# Altium schematic sheet LEDs.SchDoc
size A3; SheetNumber: 3; SheetTotal: 4
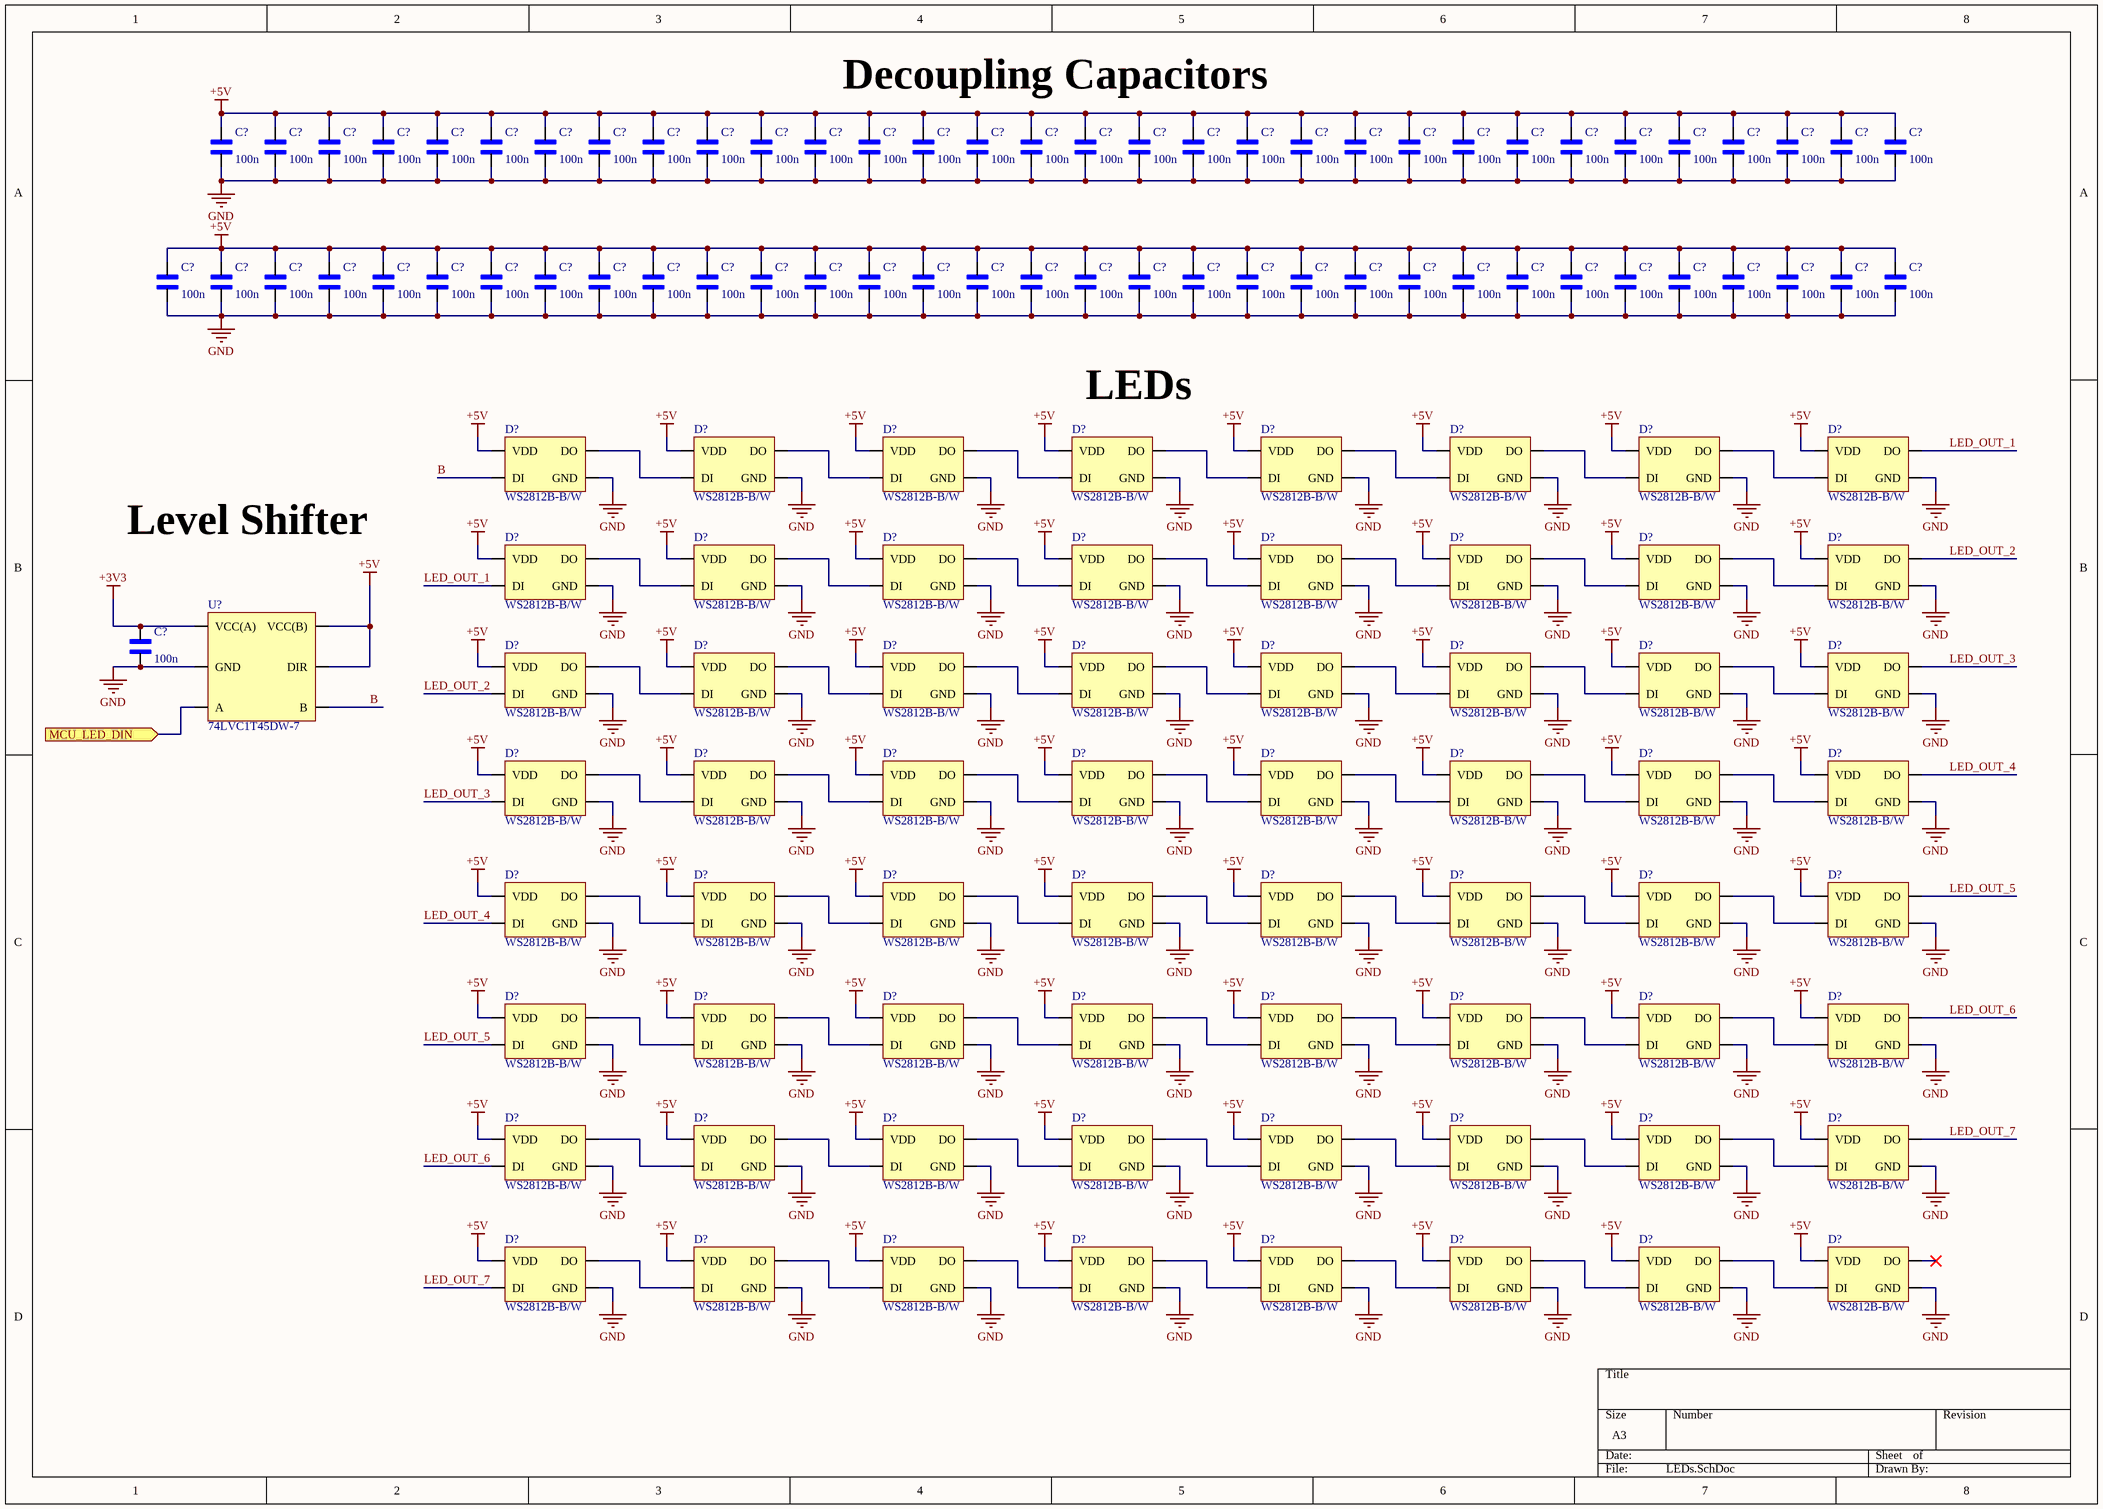
[diagram p0: LEDs.SchDoc]

## Parts
(Parts that share a designator on the sheet are numbered #1, #2 ... from top to bottom, then left to right.)
C?#1  100n  [CAP 0805]
C?#2  100n  [CAP 0805]
C?#3  100n  [CAP 0805]
C?#4  100n  [CAP 0805]
C?#5  100n  [CAP 0805]
C?#6  100n  [CAP 0805]
C?#7  100n  [CAP 0805]
C?#8  100n  [CAP 0805]
C?#9  100n  [CAP 0805]
C?#10  100n  [CAP 0805]
C?#11  100n  [CAP 0805]
C?#12  100n  [CAP 0805]
C?#13  100n  [CAP 0805]
C?#14  100n  [CAP 0805]
C?#15  100n  [CAP 0805]
C?#16  100n  [CAP 0805]
C?#17  100n  [CAP 0805]
C?#18  100n  [CAP 0805]
C?#19  100n  [CAP 0805]
C?#20  100n  [CAP 0805]
C?#21  100n  [CAP 0805]
C?#22  100n  [CAP 0805]
C?#23  100n  [CAP 0805]
C?#24  100n  [CAP 0805]
C?#25  100n  [CAP 0805]
C?#26  100n  [CAP 0805]
C?#27  100n  [CAP 0805]
C?#28  100n  [CAP 0805]
C?#29  100n  [CAP 0805]
C?#30  100n  [CAP 0805]
C?#31  100n  [CAP 0805]
C?#32  100n  [CAP 0805]
C?#33  100n  [CAP 0805]
C?#34  100n  [CAP 0805]
C?#35  100n  [CAP 0805]
C?#36  100n  [CAP 0805]
C?#37  100n  [CAP 0805]
C?#38  100n  [CAP 0805]
C?#39  100n  [CAP 0805]
C?#40  100n  [CAP 0805]
C?#41  100n  [CAP 0805]
C?#42  100n  [CAP 0805]
C?#43  100n  [CAP 0805]
C?#44  100n  [CAP 0805]
C?#45  100n  [CAP 0805]
C?#46  100n  [CAP 0805]
C?#47  100n  [CAP 0805]
C?#48  100n  [CAP 0805]
C?#49  100n  [CAP 0805]
C?#50  100n  [CAP 0805]
C?#51  100n  [CAP 0805]
C?#52  100n  [CAP 0805]
C?#53  100n  [CAP 0805]
C?#54  100n  [CAP 0805]
C?#55  100n  [CAP 0805]
C?#56  100n  [CAP 0805]
C?#57  100n  [CAP 0805]
C?#58  100n  [CAP 0805]
C?#59  100n  [CAP 0805]
C?#60  100n  [CAP 0805]
C?#61  100n  [CAP 0805]
C?#62  100n  [CAP 0805]
C?#63  100n  [CAP 0805]
C?#64  100n  [CAP 0805]
C?#65  100n  [CAP 0805]
C?#66  100n  [CAP 0805]
D?#1  WS2812B-B/W
D?#2  WS2812B-B/W
D?#3  WS2812B-B/W
D?#4  WS2812B-B/W
D?#5  WS2812B-B/W
D?#6  WS2812B-B/W
D?#7  WS2812B-B/W
D?#8  WS2812B-B/W
D?#9  WS2812B-B/W
D?#10  WS2812B-B/W
D?#11  WS2812B-B/W
D?#12  WS2812B-B/W
D?#13  WS2812B-B/W
D?#14  WS2812B-B/W
D?#15  WS2812B-B/W
D?#16  WS2812B-B/W
D?#17  WS2812B-B/W
D?#18  WS2812B-B/W
D?#19  WS2812B-B/W
D?#20  WS2812B-B/W
D?#21  WS2812B-B/W
D?#22  WS2812B-B/W
D?#23  WS2812B-B/W
D?#24  WS2812B-B/W
D?#25  WS2812B-B/W
D?#26  WS2812B-B/W
D?#27  WS2812B-B/W
D?#28  WS2812B-B/W
D?#29  WS2812B-B/W
D?#30  WS2812B-B/W
D?#31  WS2812B-B/W
D?#32  WS2812B-B/W
D?#33  WS2812B-B/W
D?#34  WS2812B-B/W
D?#35  WS2812B-B/W
D?#36  WS2812B-B/W
D?#37  WS2812B-B/W
D?#38  WS2812B-B/W
D?#39  WS2812B-B/W
D?#40  WS2812B-B/W
D?#41  WS2812B-B/W
D?#42  WS2812B-B/W
D?#43  WS2812B-B/W
D?#44  WS2812B-B/W
D?#45  WS2812B-B/W
D?#46  WS2812B-B/W
D?#47  WS2812B-B/W
D?#48  WS2812B-B/W
D?#49  WS2812B-B/W
D?#50  WS2812B-B/W
D?#51  WS2812B-B/W
D?#52  WS2812B-B/W
D?#53  WS2812B-B/W
D?#54  WS2812B-B/W
D?#55  WS2812B-B/W
D?#56  WS2812B-B/W
D?#57  WS2812B-B/W
D?#58  WS2812B-B/W
D?#59  WS2812B-B/W
D?#60  WS2812B-B/W
D?#61  WS2812B-B/W
D?#62  WS2812B-B/W
D?#63  WS2812B-B/W
D?#64  WS2812B-B/W
U?  74LVC1T45DW-7  [74LVC1T45DW-7]

## Ports
MCU_LED_DIN (in)

## Nets
+3V3: C?#66.2 U?.1(VCC(A))
+5V: C?#1.2 C?#2.2 C?#3.2 C?#4.2 C?#5.2 C?#6.2 C?#7.2 C?#8.2 C?#9.2 C?#10.2 C?#11.2 C?#12.2 C?#13.2 C?#14.2 C?#15.2 C?#16.2 C?#17.2 C?#18.2 C?#19.2 C?#20.2 C?#21.2 C?#22.2 C?#23.2 C?#24.2 C?#25.2 C?#26.2 C?#27.2 C?#28.2 C?#29.2 C?#30.2 C?#31.2 C?#32.2 C?#33.2 C?#34.2 C?#35.2 C?#36.2 C?#37.2 C?#38.2 C?#39.2 C?#40.2 C?#41.2 C?#42.2 C?#43.2 C?#44.2 C?#45.2 C?#46.2 C?#47.2 C?#48.2 C?#49.2 C?#50.2 C?#51.2 C?#52.2 C?#53.2 C?#54.2 C?#55.2 C?#56.2 C?#57.2 C?#58.2 C?#59.2 C?#60.2 C?#61.2 C?#62.2 C?#63.2 C?#64.2 C?#65.2 D?#1.1(VDD) D?#2.1(VDD) D?#3.1(VDD) D?#4.1(VDD) D?#5.1(VDD) D?#6.1(VDD) D?#7.1(VDD) D?#8.1(VDD) D?#9.1(VDD) D?#10.1(VDD) D?#11.1(VDD) D?#12.1(VDD) D?#13.1(VDD) D?#14.1(VDD) D?#15.1(VDD) D?#16.1(VDD) D?#17.1(VDD) D?#18.1(VDD) D?#19.1(VDD) D?#20.1(VDD) D?#21.1(VDD) D?#22.1(VDD) D?#23.1(VDD) D?#24.1(VDD) D?#25.1(VDD) D?#26.1(VDD) D?#27.1(VDD) D?#28.1(VDD) D?#29.1(VDD) D?#30.1(VDD) D?#31.1(VDD) D?#32.1(VDD) D?#33.1(VDD) D?#34.1(VDD) D?#35.1(VDD) D?#36.1(VDD) D?#37.1(VDD) D?#38.1(VDD) D?#39.1(VDD) D?#40.1(VDD) D?#41.1(VDD) D?#42.1(VDD) D?#43.1(VDD) D?#44.1(VDD) D?#45.1(VDD) D?#46.1(VDD) D?#47.1(VDD) D?#48.1(VDD) D?#49.1(VDD) D?#50.1(VDD) D?#51.1(VDD) D?#52.1(VDD) D?#53.1(VDD) D?#54.1(VDD) D?#55.1(VDD) D?#56.1(VDD) D?#57.1(VDD) D?#58.1(VDD) D?#59.1(VDD) D?#60.1(VDD) D?#61.1(VDD) D?#62.1(VDD) D?#63.1(VDD) D?#64.1(VDD) U?.5(DIR) U?.6(VCC(B))
GND: C?#1.1 C?#2.1 C?#3.1 C?#4.1 C?#5.1 C?#6.1 C?#7.1 C?#8.1 C?#9.1 C?#10.1 C?#11.1 C?#12.1 C?#13.1 C?#14.1 C?#15.1 C?#16.1 C?#17.1 C?#18.1 C?#19.1 C?#20.1 C?#21.1 C?#22.1 C?#23.1 C?#24.1 C?#25.1 C?#26.1 C?#27.1 C?#28.1 C?#29.1 C?#30.1 C?#31.1 C?#32.1 C?#33.1 C?#34.1 C?#35.1 C?#36.1 C?#37.1 C?#38.1 C?#39.1 C?#40.1 C?#41.1 C?#42.1 C?#43.1 C?#44.1 C?#45.1 C?#46.1 C?#47.1 C?#48.1 C?#49.1 C?#50.1 C?#51.1 C?#52.1 C?#53.1 C?#54.1 C?#55.1 C?#56.1 C?#57.1 C?#58.1 C?#59.1 C?#60.1 C?#61.1 C?#62.1 C?#63.1 C?#64.1 C?#65.1 C?#66.1 D?#1.4(GND) D?#2.4(GND) D?#3.4(GND) D?#4.4(GND) D?#5.4(GND) D?#6.4(GND) D?#7.4(GND) D?#8.4(GND) D?#9.4(GND) D?#10.4(GND) D?#11.4(GND) D?#12.4(GND) D?#13.4(GND) D?#14.4(GND) D?#15.4(GND) D?#16.4(GND) D?#17.4(GND) D?#18.4(GND) D?#19.4(GND) D?#20.4(GND) D?#21.4(GND) D?#22.4(GND) D?#23.4(GND) D?#24.4(GND) D?#25.4(GND) D?#26.4(GND) D?#27.4(GND) D?#28.4(GND) D?#29.4(GND) D?#30.4(GND) D?#31.4(GND) D?#32.4(GND) D?#33.4(GND) D?#34.4(GND) D?#35.4(GND) D?#36.4(GND) D?#37.4(GND) D?#38.4(GND) D?#39.4(GND) D?#40.4(GND) D?#41.4(GND) D?#42.4(GND) D?#43.4(GND) D?#44.4(GND) D?#45.4(GND) D?#46.4(GND) D?#47.4(GND) D?#48.4(GND) D?#49.4(GND) D?#50.4(GND) D?#51.4(GND) D?#52.4(GND) D?#53.4(GND) D?#54.4(GND) D?#55.4(GND) D?#56.4(GND) D?#57.4(GND) D?#58.4(GND) D?#59.4(GND) D?#60.4(GND) D?#61.4(GND) D?#62.4(GND) D?#63.4(GND) D?#64.4(GND) U?.2(GND)
B: D?#1.2(DI) U?.4(B)
LED_OUT_1: D?#8.3(DO) D?#9.2(DI)
LED_OUT_2: D?#16.3(DO) D?#17.2(DI)
LED_OUT_3: D?#24.3(DO) D?#25.2(DI)
LED_OUT_4: D?#32.3(DO) D?#33.2(DI)
LED_OUT_5: D?#40.3(DO) D?#41.2(DI)
LED_OUT_6: D?#48.3(DO) D?#49.2(DI)
LED_OUT_7: D?#56.3(DO) D?#57.2(DI)
MCU_LED_DIN: U?.3(A) ; port MCU_LED_DIN
NetD?#1_3: D?#1.3(DO) D?#2.2(DI)
NetD?#2_3: D?#2.3(DO) D?#3.2(DI)
NetD?#3_3: D?#3.3(DO) D?#4.2(DI)
NetD?#4_3: D?#4.3(DO) D?#5.2(DI)
NetD?#5_3: D?#5.3(DO) D?#6.2(DI)
NetD?#6_3: D?#6.3(DO) D?#7.2(DI)
NetD?#7_3: D?#7.3(DO) D?#8.2(DI)
NetD?#9_3: D?#9.3(DO) D?#10.2(DI)
NetD?#10_3: D?#10.3(DO) D?#11.2(DI)
NetD?#11_3: D?#11.3(DO) D?#12.2(DI)
NetD?#12_3: D?#12.3(DO) D?#13.2(DI)
NetD?#13_3: D?#13.3(DO) D?#14.2(DI)
NetD?#14_3: D?#14.3(DO) D?#15.2(DI)
NetD?#15_3: D?#15.3(DO) D?#16.2(DI)
NetD?#17_3: D?#17.3(DO) D?#18.2(DI)
NetD?#18_3: D?#18.3(DO) D?#19.2(DI)
NetD?#19_3: D?#19.3(DO) D?#20.2(DI)
NetD?#20_3: D?#20.3(DO) D?#21.2(DI)
NetD?#21_3: D?#21.3(DO) D?#22.2(DI)
NetD?#22_3: D?#22.3(DO) D?#23.2(DI)
NetD?#23_3: D?#23.3(DO) D?#24.2(DI)
NetD?#25_3: D?#25.3(DO) D?#26.2(DI)
NetD?#26_3: D?#26.3(DO) D?#27.2(DI)
NetD?#27_3: D?#27.3(DO) D?#28.2(DI)
NetD?#28_3: D?#28.3(DO) D?#29.2(DI)
NetD?#29_3: D?#29.3(DO) D?#30.2(DI)
NetD?#30_3: D?#30.3(DO) D?#31.2(DI)
NetD?#31_3: D?#31.3(DO) D?#32.2(DI)
NetD?#33_3: D?#33.3(DO) D?#34.2(DI)
NetD?#34_3: D?#34.3(DO) D?#35.2(DI)
NetD?#35_3: D?#35.3(DO) D?#36.2(DI)
NetD?#36_3: D?#36.3(DO) D?#37.2(DI)
NetD?#37_3: D?#37.3(DO) D?#38.2(DI)
NetD?#38_3: D?#38.3(DO) D?#39.2(DI)
NetD?#39_3: D?#39.3(DO) D?#40.2(DI)
NetD?#41_3: D?#41.3(DO) D?#42.2(DI)
NetD?#42_3: D?#42.3(DO) D?#43.2(DI)
NetD?#43_3: D?#43.3(DO) D?#44.2(DI)
NetD?#44_3: D?#44.3(DO) D?#45.2(DI)
NetD?#45_3: D?#45.3(DO) D?#46.2(DI)
NetD?#46_3: D?#46.3(DO) D?#47.2(DI)
NetD?#47_3: D?#47.3(DO) D?#48.2(DI)
NetD?#49_3: D?#49.3(DO) D?#50.2(DI)
NetD?#50_3: D?#50.3(DO) D?#51.2(DI)
NetD?#51_3: D?#51.3(DO) D?#52.2(DI)
NetD?#52_3: D?#52.3(DO) D?#53.2(DI)
NetD?#53_3: D?#53.3(DO) D?#54.2(DI)
NetD?#54_3: D?#54.3(DO) D?#55.2(DI)
NetD?#55_3: D?#55.3(DO) D?#56.2(DI)
NetD?#57_3: D?#57.3(DO) D?#58.2(DI)
NetD?#58_3: D?#58.3(DO) D?#59.2(DI)
NetD?#59_3: D?#59.3(DO) D?#60.2(DI)
NetD?#60_3: D?#60.3(DO) D?#61.2(DI)
NetD?#61_3: D?#61.3(DO) D?#62.2(DI)
NetD?#62_3: D?#62.3(DO) D?#63.2(DI)
NetD?#63_3: D?#63.3(DO) D?#64.2(DI)

Not connected (* = marked no-connect by the designer): D?#64 3(DO)*

## Notes on the sheet
- (near C?#13) Decoupling Capacitors
- (near D?#4) LEDs
- Level Shifter

## Library data of the parts
C?#1-C?#66 = CAP 0805: SnapEDA_Link: https://www.snapeda.com/parts/C2012X8R1H104K125AA/TDK/view-part/?ref=snap; Check_prices: https://www.snapeda.com/parts/C2012X8R1H104K125AA/TDK/view-part/?ref=eda; Value: *
D?#1-D?#64 = WS2812B-B/W: SMD5050 RGB LEDs(Built-in IC) ROHS; Manufacturer: Worldsemi; Supplier: LCSC; Supplier Part Number: C114586; Manufacturer Part Number: WS2812B-B/W
U? = 74LVC1T45DW-7: Bus Transceiver, LVC/LCX/Z Series, 1-Func, 1-Bit, True Output, CMOS, PDSO6; Manufacturer: Diodes; Package Body Material: Plastic; Control Type: COMMON CONTROL; Count Direction: Bidirectional; Load/Preset Input: Yes; Max I(ol): 24mA; Number of Bits: 1; Number of Ports: 2; Output Characteristics: 3-STATE; Package Equivalence Code: TSSOP6,.08; Power Supplies: 3.3V; Max Supply Voltage: 5.5V; Min Supply Voltage: 1.65V; Qualification Status: Not Qualified; Supplier: Future Electronics; Supplier Part Number: 3070442; Manufacturer Part Number: 74LVC1T45DW-7; RoHS: Yes; Stock: 42000; Pricing: 3000=0.0512, 9000=0.0494, 15000=0.0485, 60000=0.0463, 90000=0.0449 (USD); Case/Package: TSSOP; Pins: 6; Package Shape: Rectangular; Terminal Finish: Tin; Min Operating Temperature: -40°C; Max Operating Temperature: 125°C; JESD-609 Code: e3; Output Polarity: True; JESD-30 Code: R-PDSO-G6; Logic Type: BUS TRANSCEIVER; Moisture Sensitivity Level: 1; Channels: 1; Package Style: SMALL OUTLINE, THIN PROFILE, SHRINK PITCHMeter; Packaging: Tape and Reel; Nominal Supply Voltage: 3.3V; Surface Mount: Yes; Technology: CMOS; Terminal Form: Gull Wing; Terminal Position: DUAL; Length: 2mm; Width: 1.25mm; Height - Seated (Max): 1.1mm; Terminal Pitch: 0.65mm; Temperature Grade: AUTOMOTIVE; Reach SVHC Compliant: Yes; RoHS Compliant: Yes; ComponentLink1URL: https://datasheet.ciiva.com:443/pdfs/VipMasterIC/IC/DIOD/DIOD-S-A0006644025/DIOD-S-A0006644025-1.pdf?src-supplier=IHS+Markit; ComponentLink1Description: https://datasheet.ciiva.com:443/pdfs/VipMasterIC/IC/DIOD/DIOD-S-A0006644025/DIOD-S-A0006644025-1.pdf?src-supplier=IHS+Markit; ComponentLink2URL: http://www.mouser.com/ds/2/115/74LVC1T45-318124.pdf?src-supplier=Mouser; ComponentLink2Description: http://www.mouser.com/ds/2/115/74LVC1T45-318124.pdf?src-supplier=Mouser; ComponentLink3URL: https://www.diodes.com/assets/Datasheets/74LVC1T45.pdf?src-supplier=Digikey; ComponentLink3Description: https://www.diodes.com/assets/Datasheets/74LVC1T45.pdf?src-supplier=Digikey; ComponentLink4URL: https://datasheet.octopart.com/74LVC1T45DW-7-Diodes-Inc.-datasheet-160640065.pdf?src-supplier=Newark; ComponentLink4Description: https://datasheet.octopart.com/74LVC1T45DW-7-Diodes-Inc.-datasheet-160640065.pdf?src-supplier=Newark; ComponentLink5URL: http://www.diodes.com/datasheets/74LVC1T45.pdf?src-supplier=Avnet; ComponentLink5Description: http://www.diodes.com/datasheets/74LVC1T45.pdf?src-supplier=Avnet